# EAGLE schematic NavigationBoard (EAGLE 6.3)
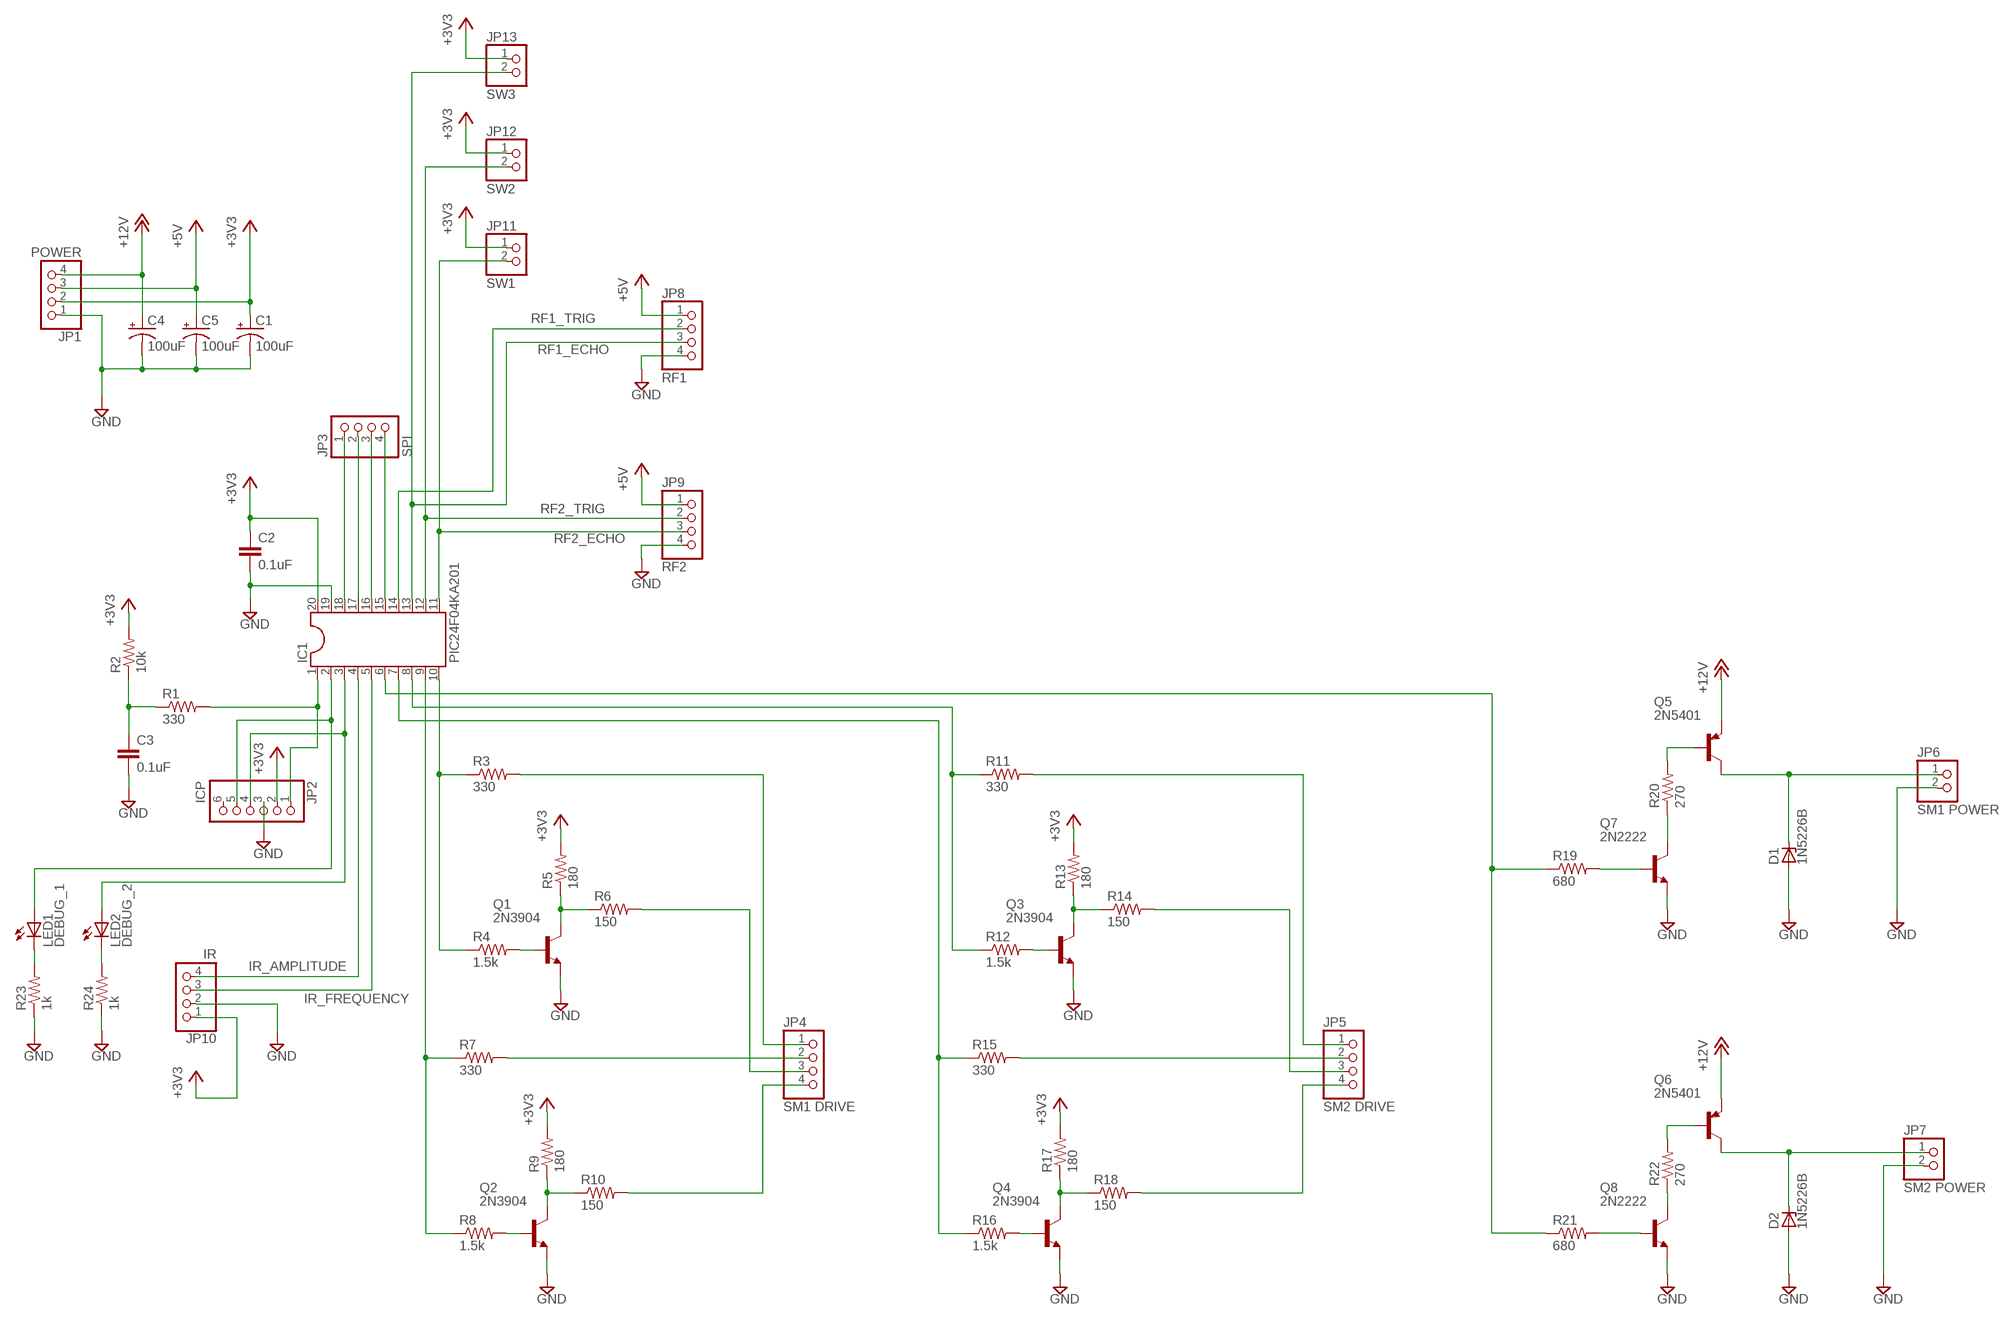
[diagram p0: schematic, sheet 1]

## Parts
C1  100uF  CPOL-USE2.5-7  [E2,5-7]
C2  0.1uF  C-EUC0805  [C0805]
C3  0.1uF  C-EUC0805  [C0805]
C4  100uF  CPOL-USE2.5-7  [E2,5-7]
C5  100uF  CPOL-USE2.5-7  [E2,5-7]
D1  1N5226B  ZPD  [DO35Z10]
D2  1N5226B  ZPD  [DO35Z10]
IC1  PIC24F04KA201  DIL20S  [SOCKET-20]
JP1  POWER  PINHD-1X4  [1X04]
JP2  ICP  PINHD-1X6  [1X06]
JP3  SPI  PINHD-1X4  [1X04]
JP4  SM1 DRIVE  PINHD-1X4  [1X04]
JP5  SM2 DRIVE  PINHD-1X4  [1X04]
JP6  SM1 POWER  PINHD-1X2  [1X02]
JP7  SM2 POWER  PINHD-1X2  [1X02]
JP8  RF1  PINHD-1X4  [1X04]
JP9  RF2  PINHD-1X4  [1X04]
JP10  IR  PINHD-1X4  [1X04]
JP11  SW1  PINHD-1X2  [1X02]
JP12  SW2  PINHD-1X2  [1X02]
JP13  SW3  PINHD-1X2  [1X02]
LED1  DEBUG_1  LED3MM  [LED3MM]
LED2  DEBUG_2  LED3MM  [LED3MM]
Q1  2N3904  [TO92]
Q2  2N3904  [TO92]
Q3  2N3904  [TO92]
Q4  2N3904  [TO92]
Q5  2N5401  2N3906  [TO92]
Q6  2N5401  2N3906  [TO92]
Q7  2N2222  2N3904  [TO92]
Q8  2N2222  2N3904  [TO92]
R1  330  R-US_R0805  [R0805]
R2  10k  R-US_R0805  [R0805]
R3  330  R-US_R0805  [R0805]
R4  1.5k  R-US_R0805  [R0805]
R5  180  R-US_R0805  [R0805]
R6  150  R-US_R0805  [R0805]
R7  330  R-US_R0805  [R0805]
R8  1.5k  R-US_R0805  [R0805]
R9  180  R-US_R0805  [R0805]
R10  150  R-US_R0805  [R0805]
R11  330  R-US_R0805  [R0805]
R12  1.5k  R-US_R0805  [R0805]
R13  180  R-US_R0805  [R0805]
R14  150  R-US_R0805  [R0805]
R15  330  R-US_R0805  [R0805]
R16  1.5k  R-US_R0805  [R0805]
R17  180  R-US_R0805  [R0805]
R18  150  R-US_R0805  [R0805]
R19  680  R-US_R0805  [R0805]
R20  270  R-US_R0805  [R0805]
R21  680  R-US_R0805  [R0805]
R22  270  R-US_R0805  [R0805]
R23  1k  R-US_R0805  [R0805]
R24  1k  R-US_R0805  [R0805]

## Nets
+3V3: C1.+ C2.1 IC1.20 JP1.2 JP2.2 JP10.1 JP11.1 JP12.1 JP13.1 R2.2 R5.2 R9.2 R13.2 R17.2
+5V: C5.+ JP1.3 JP8.1 JP9.1
+12V: C4.+ JP1.4 Q5.3(E) Q6.3(E)
GND: C1.- C2.2 C3.2 C4.- C5.- D1.A D2.A IC1.19 JP1.1 JP2.3 JP6.2 JP7.2 JP8.4 JP9.4 JP10.2 Q1.3(E) Q2.3(E) Q3.3(E) Q4.3(E) Q7.3(E) Q8.3(E) R23.1 R24.1
IR_AMPLITUDE: IC1.4 JP10.4
IR_FREQUENCY: IC1.5 JP10.3
N$1: IC1.1 JP2.1 R1.2
N$2: C3.1 R1.1 R2.1
N$3: IC1.2 JP2.5 LED1.A
N$4: IC1.3 JP2.4 LED2.A
N$5: IC1.10 R3.1 R4.1
N$6: Q1.1(C) R5.1 R6.1
N$7: Q1.2(B) R4.2
N$8: IC1.9 R7.1 R8.1
N$9: Q2.1(C) R9.1 R10.1
N$10: Q2.2(B) R8.2
N$11: IC1.8 R11.1 R12.1
N$12: Q3.1(C) R13.1 R14.1
N$13: Q3.2(B) R12.2
N$14: IC1.7 R15.1 R16.1
N$15: Q4.1(C) R17.1 R18.1
N$16: Q4.2(B) R16.2
N$17: JP4.1 R3.2
N$18: JP4.2 R7.2
N$19: JP4.3 R6.2
N$20: JP4.4 R10.2
N$21: JP5.1 R11.2
N$22: JP5.2 R15.2
N$23: JP5.3 R14.2
N$24: JP5.4 R18.2
N$25: Q8.1(C) R22.1
N$26: Q7.1(C) R20.1
N$27: Q5.2(B) R20.2
N$28: D1.C JP6.1 Q5.1(C)
N$29: Q6.2(B) R22.2
N$30: D2.C JP7.1 Q6.1(C)
N$31: Q7.2(B) R19.2
N$32: Q8.2(B) R21.2
N$33: IC1.6 R19.1 R21.1
N$34: IC1.18 JP3.1
N$35: IC1.17 JP3.2
N$36: IC1.16 JP3.3
N$37: IC1.15 JP3.4
N$38: LED1.K(C) R23.2
N$39: LED2.K(C) R24.2
RF1_ECHO: IC1.13 JP8.3 JP13.2
RF1_TRIG: IC1.14 JP8.2
RF2_ECHO: IC1.11 JP9.3 JP11.2
RF2_TRIG: IC1.12 JP9.2 JP12.2
Unconnected: JP2.6

## Library data of the parts
C1 C4 C5 = rcl:CPOL-US: POLARIZED CAPACITOR, American symbol
C2 C3 = rcl:C-EU: CAPACITOR, European symbol
D1 D2 = diode:ZPD: Z DIODE 500 mW
IC1 = ic-package:DIL20: Dual In Line / Socket
JP1 JP3-JP5 JP8-JP10 = pinhead:PINHD-1X4: PIN HEADER
JP2 = pinhead:PINHD-1X6: PIN HEADER
JP6 JP7 JP11-JP13 = pinhead:PINHD-1X2: PIN HEADER
LED1 LED2 = led:LED: LED OSRAM: - CHIPLED LG R971, LG N971, LY N971, LG Q971, LY Q971, LO R971, LY R971 LH N974, LH R974 LS Q976, LO Q976, LY Q976 LO Q996 - Hyper CHIPLED LW Q18S LB Q993, LB Q99A, LB R99A - SideLED LS A670, LO A670, LY A670, LG A670, LP A670 LB A673, LV A673, LT A673, LW A673 LH A674 LY A675 LS A676, LA A676, LO A676, LY A676, LW A676 LS A679, LY A679, LG A679 - Hyper Micro SIDELED® LS Y876, LA Y876, LO Y876, LY Y876 LT Y87S - SmartLED LW L88C, LW L88S LB L89C, LB L89S, LG L890 LS L89K, LO L89K, LY L89K LS L896, LA L896, LO L896, LY L896 - TOPLED LS T670, LO T670, LY T670, LG T670, LP T670 LSG T670, LSP T670, LSY T670, LOP T670, LYG T670 LG T671, LOG T671, LSG T671 LB T673, LV T673, LT T673, LW T673 LH T674 LS T676, LA T676, LO T676, LY T676, LB T676, LH T676, LSB T676, LW T676 LB T67C, LV T67C, LT T67C, LS T67K, LO T67K, LY T67K, LW E67C LS E67B, LA E67B, LO E67B, LY E67B, LB E67C, LV E67C, LT E67C LW T67C LS T679, LY T679, LG T679 LS T770, LO T770, LY T770, LG T770, LP T770 LB T773, LV T773, LT T773, LW T773 LH T774 LS E675, LA E675, LY E675, LS T675 LS T776, LA T776, LO T776, LY T776, LB T776 LHGB T686 LT T68C, LB T68C - Hyper Mini TOPLED® LB M676 - Mini TOPLED Santana® LG M470 LS M47K, LO M47K, LY M47K Source: http://www.osram.convergy.de LUXEON: - LUMILED® LXK2-PW12-R00, LXK2-PW12-S00, LXK2-PW14-U00, LXK2-PW14-V00 LXK2-PM12-R00, LXK2-PM12-S00, LXK2-PM14-U00 LXK2-PE12-Q00, LXK2-PE12-R00, LXK2-PE12-S00, LXK2-PE14-T00, LXK2-PE14-U00 LXK2-PB12-K00, LXK2-PB12-L00, LXK2-PB12-M00, LXK2-PB14-N00, LXK2-PB14-P00, LXK2-PB14-Q00 LXK2-PR12-L00, LXK2-PR12-M00, LXK2-PR14-Q00, LXK2-PR14-R00 LXK2-PD12-Q00, LXK2-PD12-R00, LXK2-PD12-S00 LXK2-PH12-R00, LXK2-PH12-S00 LXK2-PL12-P00, LXK2-PL12-Q00, LXK2-PL12-R00 Source: www.luxeon.com KINGBRIGHT: KA-3528ASYC Source: www.kingbright.com
Q1-Q4 Q7 Q8 = transistor-npn:2N3904: NPN Transistor
Q5 Q6 = transistor-pnp:2N3906: PNP Transistor
R1-R24 = rcl:R-US_: RESISTOR, American symbol